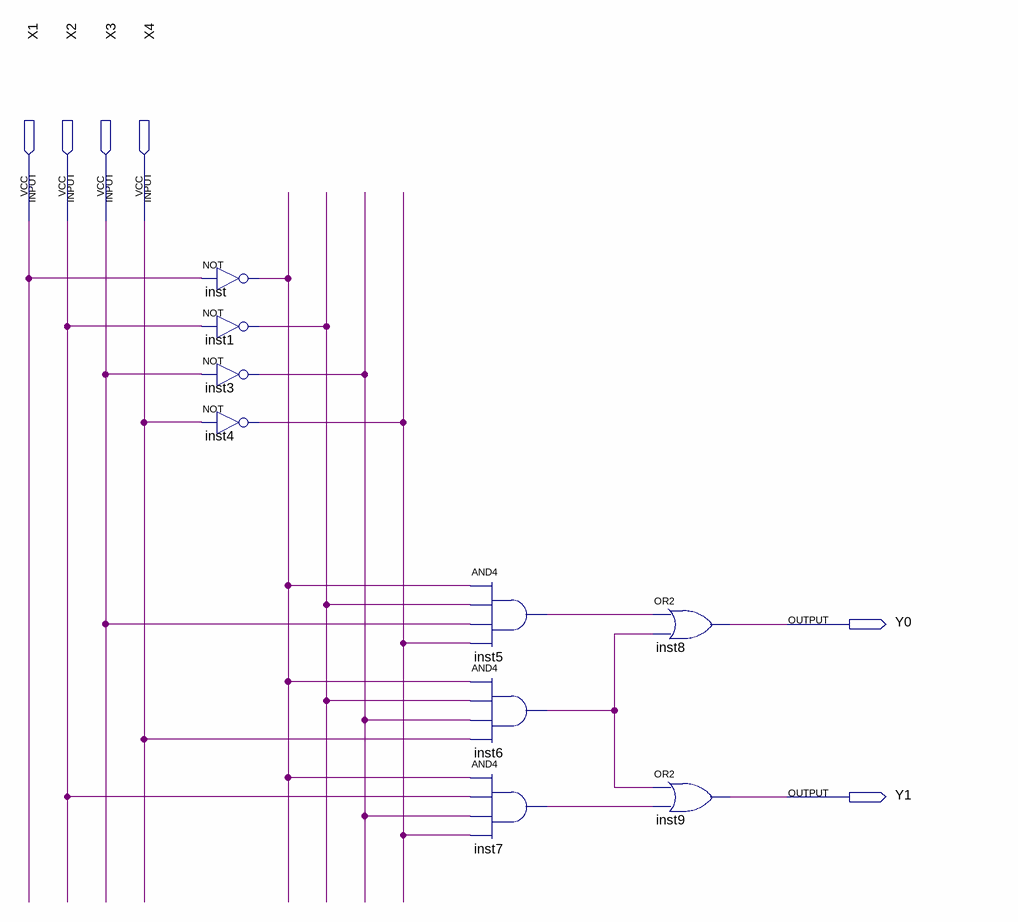
[diagram p0: schematic sheet]
// Quartus schematic lab3_2.bdf as structural Verilog: 9 symbols, 6 pins
module lab3_2 (
  input  X1,
  input  X2,
  input  X3,
  input  X4,
  output Y0,
  output Y1
);

  wire inst1_out, inst3_out, inst4_out, inst5_out, inst6_out, inst7_out, inst_out;

  not inst (inst_out, X1);
  not inst1 (inst1_out, X2);
  not inst3 (inst3_out, X3);
  not inst4 (inst4_out, X4);
  and inst5 (inst5_out, inst_out, inst1_out, X3, inst4_out);
  and inst6 (inst6_out, inst_out, inst1_out, inst3_out, X4);
  and inst7 (inst7_out, inst_out, X2, inst3_out, inst4_out);
  or inst8 (Y0, inst5_out, inst6_out);
  or inst9 (Y1, inst6_out, inst7_out);
endmodule
